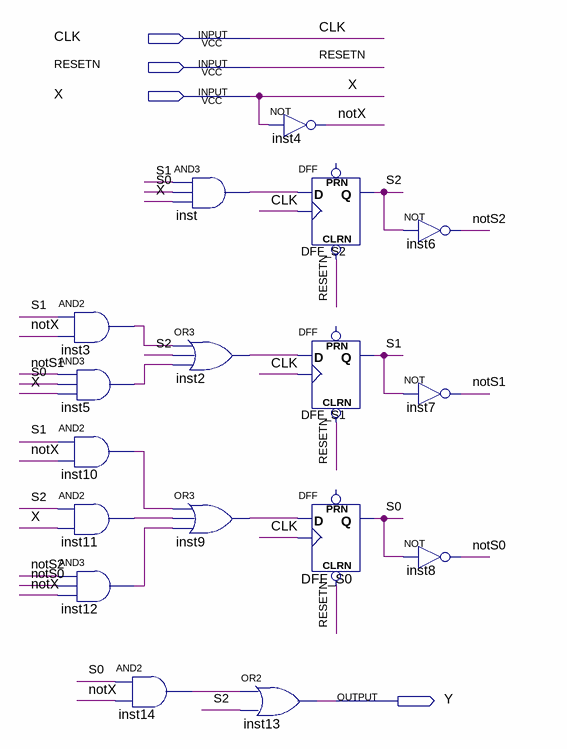
[diagram p0: schematic sheet]
// Quartus schematic Q3aD.bdf as structural Verilog: 17 symbols, 4 pins
module Q3aD (
  input  CLK,
  input  RESETN,
  input  X,
  output Y
);

  wire inst2_out, inst3_out, inst5_out, inst9_out, inst10_out, inst11_out, inst12_out, inst14_out, inst_out,
       notS0, notS1, notS2, notX, S0, S1, S2;

  and inst3 (inst3_out, S1, notX);
  and inst5 (inst5_out, notS1, S0, X);
  and inst10 (inst10_out, S1, notX);
  and inst11 (inst11_out, S2, X);
  and inst12 (inst12_out, notS2, notS0, notX);
  and inst14 (inst14_out, S0, notX);
  and inst (inst_out, S1, S0, X);
  or inst2 (inst2_out, inst3_out, S2, inst5_out);
  or inst9 (inst9_out, inst10_out, inst11_out, inst12_out);
  not inst4 (notX, X);
  DFF DFF_S2 (.CLRN(RESETN), .CLK(CLK), .D(inst_out), .Q(S2));  // open: PRN
  DFF DFF_S1 (.CLRN(RESETN), .CLK(CLK), .D(inst2_out), .Q(S1));  // open: PRN
  DFF DFF_S0 (.CLRN(RESETN), .CLK(CLK), .D(inst9_out), .Q(S0));  // open: PRN
  or inst13 (Y, inst14_out, S2);
  not inst6 (notS2, S2);
  not inst7 (notS1, S1);
  not inst8 (notS0, S0);
endmodule
